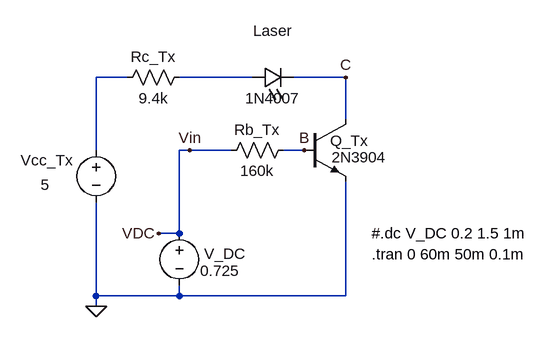
[diagram p0: schematic elec310_proj_DCTx.asc]
elec310_proj_DCTx.asc, the LTspice schematic file:
Version 4
SHEET 1 1640 680
WIRE -96 -32 -144 -32
WIRE 96 -32 -16 -32
WIRE 240 -32 160 -32
WIRE 240 32 240 -32
WIRE -144 80 -144 -32
WIRE 0 80 -16 80
WIRE 64 80 0 80
WIRE 176 80 144 80
WIRE -16 208 -16 80
WIRE -16 208 -48 208
WIRE -144 304 -144 160
WIRE -16 304 -16 288
WIRE -16 304 -144 304
WIRE 240 304 240 128
WIRE 240 304 -16 304
WIRE -144 320 -144 304
FLAG 0 80 Vin
FLAG -144 320 0
FLAG -48 208 VDC
FLAG 240 -32 C
FLAG 176 80 B
SYMBOL npn 176 32 R0
WINDOW 0 40 33 Left 2
WINDOW 3 42 59 Left 2
SYMATTR InstName Q_Tx
SYMATTR Value 2N3904
SYMBOL voltage -144 64 R0
WINDOW 123 0 0 Left 0
WINDOW 39 0 0 Left 0
WINDOW 0 -116 31 Left 2
WINDOW 3 -85 69 Left 2
SYMATTR InstName Vcc_Tx
SYMATTR Value 5
SYMBOL res 0 -48 R90
WINDOW 0 0 56 VBottom 2
WINDOW 3 32 56 VTop 2
SYMATTR InstName Rc_Tx
SYMATTR Value 9.4k
SYMBOL res 160 64 R90
WINDOW 0 0 56 VBottom 2
WINDOW 3 32 56 VTop 2
SYMATTR InstName Rb_Tx
SYMATTR Value 160k
SYMBOL LED 96 -16 R270
WINDOW 0 72 32 VTop 2
WINDOW 3 0 32 VBottom 2
SYMATTR InstName Laser
SYMATTR Value 1N4007
SYMBOL voltage -16 192 R0
WINDOW 0 38 47 Left 2
WINDOW 3 32 73 Left 2
WINDOW 123 0 0 Left 0
WINDOW 39 0 0 Left 0
SYMATTR InstName V_DC
SYMATTR Value 0.725
TEXT 280 240 Left 2 !.tran 0 60m 50m 0.1m
TEXT 280 208 Left 2 !#.dc V_DC 0.2 1.5 1m

The netlist it stands for:
* elec310_proj_DCTx.asc
Q_Tx C B 0 0 2N3904
Vcc_Tx N001 0 5
Rc_Tx N002 N001 9.4k
Rb_Tx B VDC 160k
D§Laser N002 C 1N4007
V_DC VDC 0 0.725
.model D D
.lib standard.dio
.model NPN NPN
.model PNP PNP
.lib standard.bjt
.tran 0 60m 50m 0.1m
#.dc V_DC 0.2 1.5 1m
.backanno
.end